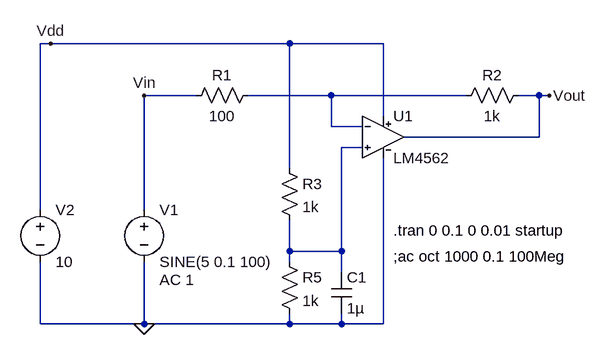
[diagram p0: schematic Test.asc]
Test.asc, the LTspice schematic file:
Version 4
SHEET 1 1656 680
WIRE -224 0 -240 0
WIRE 144 0 -224 0
WIRE 288 0 144 0
WIRE 0 80 -80 80
WIRE 208 80 80 80
WIRE 416 80 208 80
WIRE 528 80 496 80
WIRE 544 80 528 80
WIRE 288 112 288 0
WIRE 208 128 208 80
WIRE 256 128 208 128
WIRE 528 144 528 80
WIRE 528 144 320 144
WIRE 256 160 224 160
WIRE 144 192 144 0
WIRE -240 256 -240 0
WIRE -80 256 -80 80
WIRE 144 320 144 272
WIRE 224 320 224 160
WIRE 224 320 144 320
WIRE 144 336 144 320
WIRE 224 352 224 320
WIRE -240 432 -240 336
WIRE -80 432 -80 336
WIRE -80 432 -240 432
WIRE 144 432 144 416
WIRE 144 432 -80 432
WIRE 224 432 224 416
WIRE 224 432 144 432
WIRE 288 432 288 176
WIRE 288 432 224 432
FLAG 544 80 Vout
FLAG -80 80 Vin
FLAG -224 0 Vdd
FLAG -80 432 0
SYMBOL voltage -80 240 R0
WINDOW 123 24 124 Left 2
WINDOW 39 0 0 Left 2
SYMATTR Value2 AC 1
SYMATTR InstName V1
SYMATTR Value SINE(5 0.1 100)
SYMBOL voltage -240 240 R0
WINDOW 123 0 0 Left 2
WINDOW 39 0 0 Left 2
SYMATTR InstName V2
SYMATTR Value 10
SYMBOL res 96 64 R90
WINDOW 0 0 56 VBottom 2
WINDOW 3 32 56 VTop 2
SYMATTR InstName R1
SYMATTR Value 100
SYMBOL res 512 64 R90
WINDOW 0 0 56 VBottom 2
WINDOW 3 32 56 VTop 2
SYMATTR InstName R2
SYMATTR Value 1k
SYMBOL NewOpamps\\LM4562 288 80 R0
SYMATTR InstName U1
SYMBOL res 128 176 R0
SYMATTR InstName R3
SYMATTR Value 1k
SYMBOL cap 208 352 R0
SYMATTR InstName C1
SYMATTR Value 1µ
SYMBOL res 128 320 R0
SYMATTR InstName R5
SYMATTR Value 1k
TEXT 304 328 Left 2 !;ac oct 1000 0.1 100Meg
TEXT 304 288 Left 2 !.tran 0 0.1 0 0.01 startup

The netlist it stands for:
* Test.asc
V1 Vin 0 SINE(5 0.1 100) AC 1
V2 Vdd 0 10
R1 N001 Vin 100
R2 Vout N001 1k
XU1 N002 N001 Vdd 0 Vout LM4562  ; pins In+ In- V+ V- OUT
R3 Vdd N002 1k
C1 N002 0 1µ
R5 N002 0 1k
;ac oct 1000 0.1 100Meg
.tran 0 0.1 0 0.01 startup
.lib NewOpamps\LM4562.lib
.backanno
.end